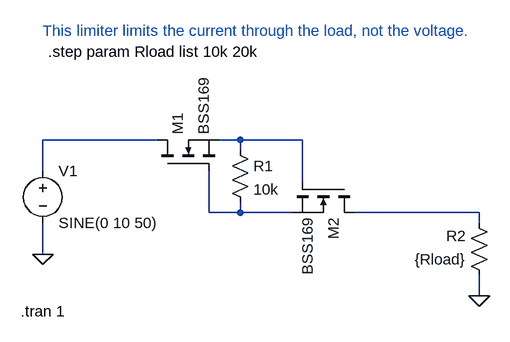
[diagram p0: schematic depletion_FET_limiter.asc]
depletion_FET_limiter.asc, the LTspice schematic file:
Version 4
SHEET 1 880 680
WIRE 208 96 32 96
WIRE 336 96 304 96
WIRE 432 96 336 96
WIRE 336 112 336 96
WIRE 32 144 32 96
WIRE 432 160 432 96
WIRE 288 208 288 144
WIRE 336 208 336 192
WIRE 336 208 288 208
WIRE 416 208 336 208
WIRE 704 208 512 208
WIRE 704 224 704 208
WIRE 32 272 32 224
WIRE 704 336 704 304
FLAG 32 272 0
FLAG 704 336 0
SYMBOL voltage 32 128 R0
WINDOW 123 0 0 Left 0
WINDOW 39 0 0 Left 0
SYMATTR InstName V1
SYMATTR Value SINE(0 10 50)
SYMBOL nmos 208 144 R270
SYMATTR InstName M1
SYMATTR Value BSS169
SYMBOL nmos 512 160 R90
SYMATTR InstName M2
SYMATTR Value BSS169
SYMBOL res 320 96 R0
SYMATTR InstName R1
SYMATTR Value 10k
SYMBOL res 720 320 R180
WINDOW 0 36 76 Left 2
WINDOW 3 36 40 Left 2
SYMATTR InstName R2
SYMATTR Value {Rload}
TEXT -2 360 Left 2 !.tran 1
TEXT 32 -72 Left 2 ;This limiter limits the current through the load, not the voltage.
TEXT 40 -40 Left 2 !.step param Rload list 10k 20k

The netlist it stands for:
* depletion_FET_limiter.asc
V1 N001 0 SINE(0 10 50)
M1 N001 N003 N002 N002 BSS169
M2 N004 N002 N003 N003 BSS169
R1 N002 N003 10k
R2 0 N004 {Rload}
.model NMOS NMOS
.model PMOS PMOS
.lib standard.mos
.tran 1
* This limiter limits the current through the load, not the voltage.
.step param Rload list 10k 20k
.backanno
.end